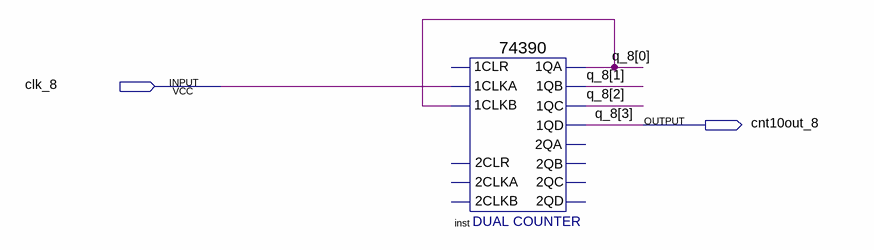
[diagram p0: schematic sheet]
// Quartus schematic cnt10_8.bdf as structural Verilog: 1 symbols, 2 pins
module cnt10_8 (
  input  clk_8,
  output cnt10out_8
);

  wire [2:0] q_8;

  \74390  inst (
    .\1CLKA (clk_8), .\1CLKB (q_8[0]), .\1QA (q_8[0]), .\1QB (q_8[1]), .\1QC (q_8[2]), .\1QD (cnt10out_8));  // open: 2CLKA, 2CLR, 2CLKB, 1CLR, 2QA, 2QB, 2QC, 2QD

  // Other names for the same wires on the sheet: q_8[3] = cnt10out_8
endmodule
